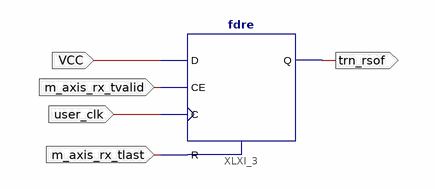
[diagram p0: schematic sheet 1]
// Xilinx ISE schematic ff.sch (kintex7) as structural Verilog: 1 symbols, 5 ports
module ff (
  input  m_axis_rx_tvalid,
  input  user_clk,
  input  m_axis_rx_tlast,
  input  VCC,
  output trn_rsof
);

  fdre XLXI_3 (.C(user_clk), .CE(m_axis_rx_tvalid), .D(VCC), .R(m_axis_rx_tlast), .Q(trn_rsof));
endmodule
